# EAGLE design Adafruit eInk Feather Friend (EAGLE 9.5.0)
COMPANY: ADAFRUIT INDUSTRIES; DRAWN: K. TOWNSEND; REV: A
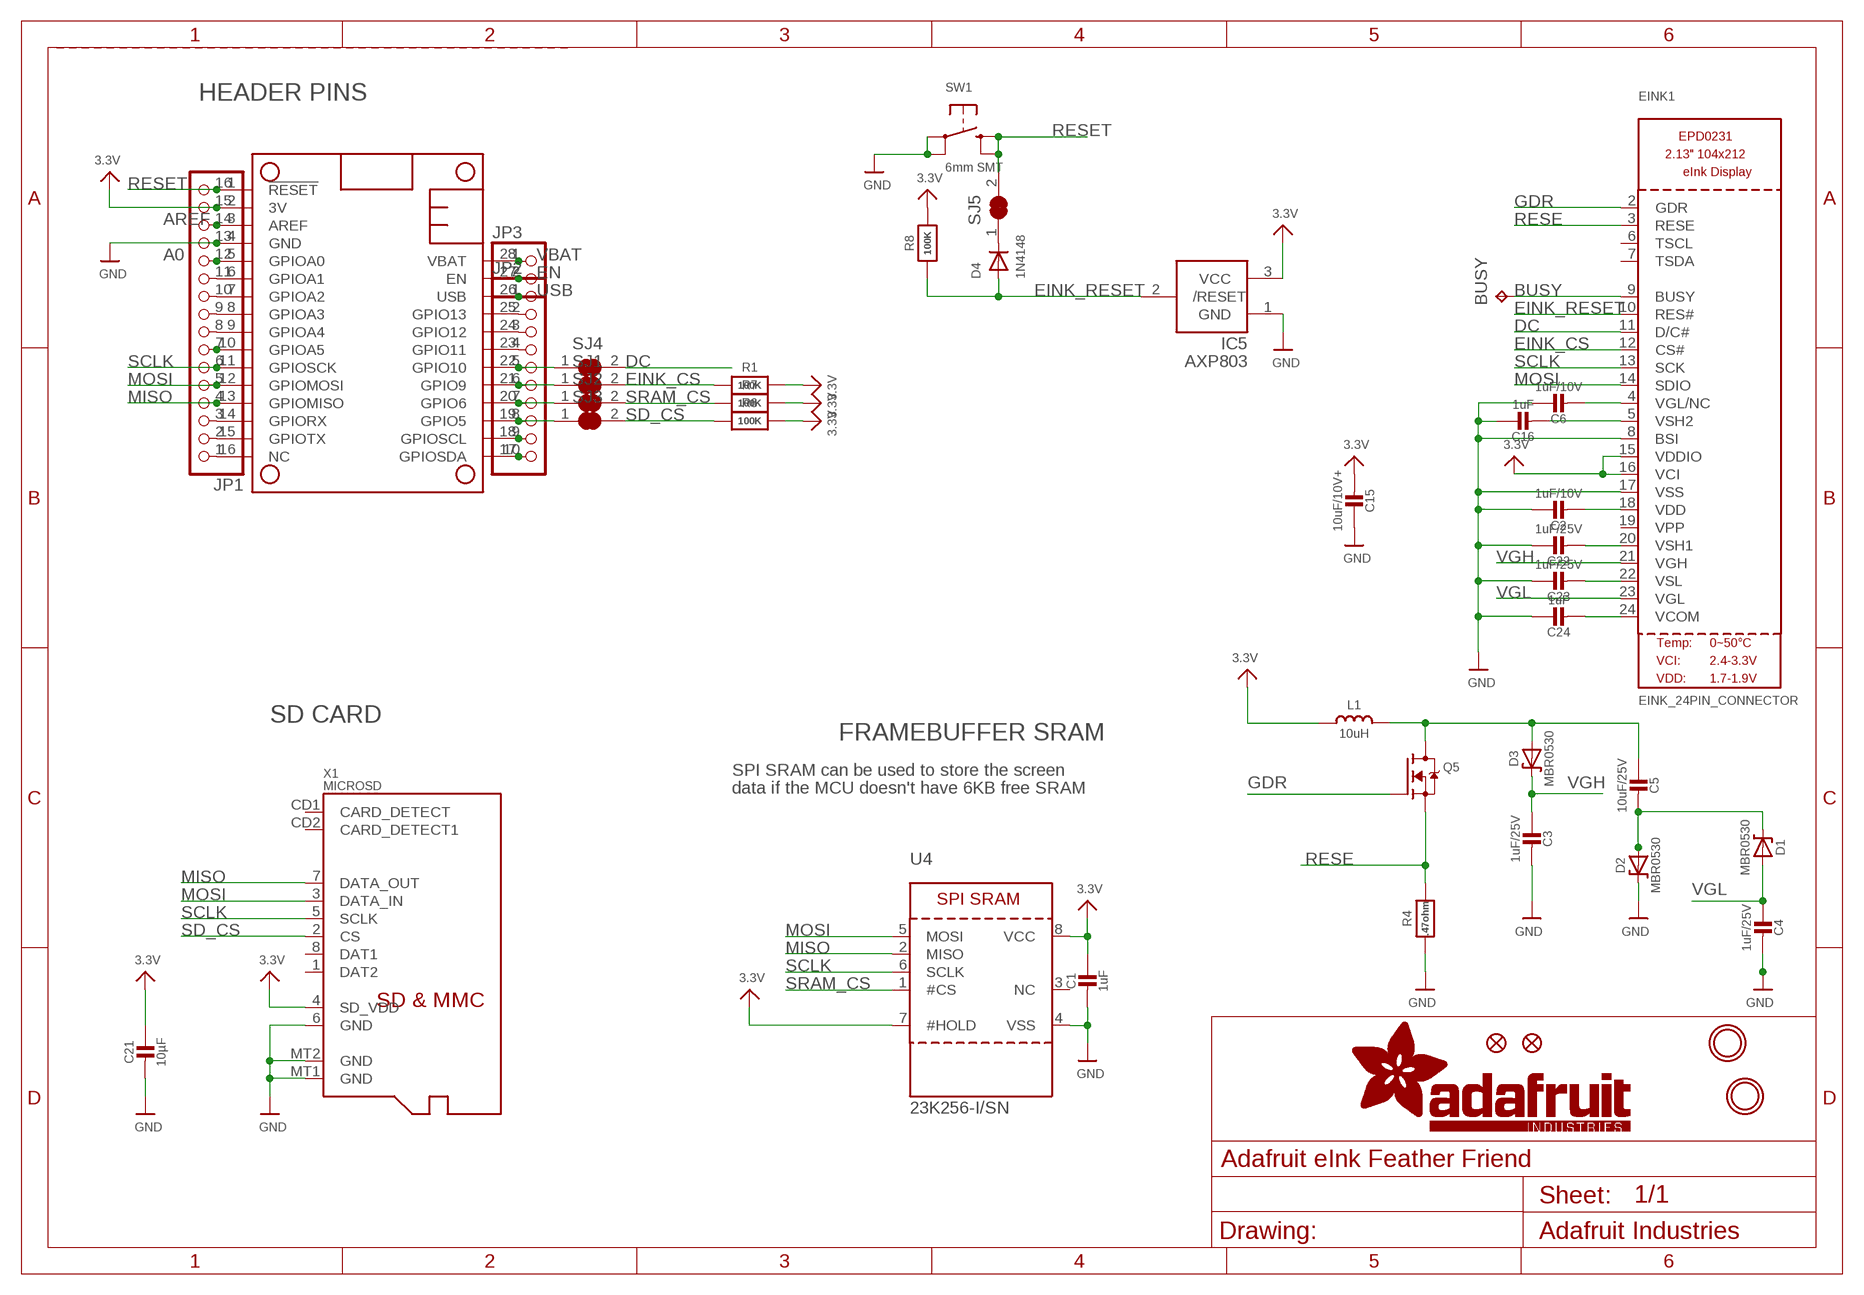
[diagram p0: schematic, sheet 1]

## Parts
BUSY  TPTP15SQ  [TP15SQ]
C1  1uF  CAP_CERAMIC0805_10MGAP  [0805_10MGAP]
C2  1uF/10V  CAP_CERAMIC0805-NOOUTLINE  [0805-NO]
C3  1uF/25V  CAP_CERAMIC0805-NOOUTLINE  [0805-NO]
C4  1uF/25V  CAP_CERAMIC0805-NOOUTLINE  [0805-NO]
C5  10uF/25V  CAP_CERAMIC0805-NOOUTLINE  [0805-NO]
C6  1uF/10V  CAP_CERAMIC0805-NOOUTLINE  [0805-NO]
C15  10uF/10V+  CAP_CERAMIC0805-NOOUTLINE  [0805-NO]
C16  1uF  CAP_CERAMIC0805-NOOUTLINE  [0805-NO]
C21  10µF  CAP_CERAMIC0805-NOOUTLINE  [0805-NO]
C22  1uF/25V  CAP_CERAMIC0805-NOOUTLINE  [0805-NO]
C23  1uF/25V  CAP_CERAMIC0805-NOOUTLINE  [0805-NO]
C24  1uF  CAP_CERAMIC0805-NOOUTLINE  [0805-NO]
D1  MBR0530  DIODE-SCHOTTKYSOD-123  [SOD-123]
D2  MBR0530  DIODE-SCHOTTKYSOD-123  [SOD-123]
D3  MBR0530  DIODE-SCHOTTKYSOD-123  [SOD-123]
D4  1N4148  DIODESOD-323F  [SOD-323F]
EINK1  EINK_24PIN_CONNECTOR  [EINK_24PIN]
FID1  FIDUCIAL_1MM  [FIDUCIAL_1MM]
FID3  FIDUCIAL_1MM  [FIDUCIAL_1MM]
IC5  AXP803  AXP083-SAG  [SOT23]
JP1  HEADER-1X16ROUND  [1X16_ROUND]
JP2  HEADER-1X10ROUND  [1X10_ROUND]
JP3  HEADER-1X2ROUND  [1X02_ROUND]
L1  10uH  INDUCTORNR401  [INDUCTOR_4X4MM_NR401]
MS1  FEATHERWING_NOHOLES  [FEATHERWING_NOHOLES]
Q5  IRLML0100  IRLML2060TRPBF  [SOT23-3]
R1  100K  RESISTOR_0603_NOOUT  [0603-NO]
R4  .47ohm  RESISTOR0805_10MGAP  [0805_10MGAP]
R6  100K  RESISTOR_0603_NOOUT  [0603-NO]
R7  100K  RESISTOR_0603_NOOUT  [0603-NO]
R8  100K  RESISTOR_0603_NOOUT  [0603-NO]
SJ1  SOLDERJUMPER_CLOSED  [SOLDERJUMPER_CLOSEDWIRE]
SJ2  SOLDERJUMPER_CLOSED  [SOLDERJUMPER_CLOSEDWIRE]
SJ3  SOLDERJUMPER_CLOSED  [SOLDERJUMPER_CLOSEDWIRE]
SJ4  SOLDERJUMPER_CLOSED  [SOLDERJUMPER_CLOSEDWIRE]
SJ5  SOLDERJUMPER_CLOSED  [SOLDERJUMPER_CLOSEDWIRE]
SW1  6mm SMT  SWITCH_TACT_SMT4.6X2.8  [BTN_KMR2_4.6X2.8]
U4  23K256-I/SN  SRAM_SPI_SOIC8  [SOIC8_150MIL]
U$3  MOUNTINGHOLE2.5  [MOUNTINGHOLE_2.5_PLATED]
U$4  MOUNTINGHOLE2.5  [MOUNTINGHOLE_2.5_PLATED]
X1  MICROSD  [MICROSD]

## Nets
3.3V: C1.1 C15.2 C21.1 EINK1.15(VDDIO) EINK1.16(VCI) IC5.3(VCC) JP1.15 L1.P$2 MS1.2(3V) R1.2 R6.2 R7.2 R8.2 U4.7(#HOLD) U4.8(VCC) X1.4(SD_VDD)
A0: JP1.12 MS1.5(GPIOA0)
AREF: JP1.14 MS1.3(AREF)
BUSY: BUSY.TP EINK1.9(BUSY)
DC: EINK1.11(D/C#) SJ4.2
EINK_CS: EINK1.12(CS#) R1.1 SJ1.2
EINK_RESET: D4.A EINK1.10(RES#) IC5.2(/RESET) R8.1
EN: JP3.2 MS1.27(EN)
GDR: EINK1.2(GDR) Q5.1(G)
GND: C1.2 C2.1 C3.2 C4.2 C6.1 C15.1 C16.1 C21.2 C22.1 C23.1 C24.1 D2.C EINK1.8(BSI) EINK1.17(VSS) IC5.1(GND) JP1.13 MS1.4(GND) R4.2 SW1.A'(P1) SW1.A(P) U4.4(VSS) X1.6(GND) X1.MT1(GND) X1.MT2(GND)
H: JP2.8 MS1.19(GPIO5) SJ3.1
I: JP2.7 MS1.20(GPIO6) SJ2.1
J: JP2.6 MS1.21(GPIO9) SJ1.1
K: JP2.5 MS1.22(GPIO10) SJ4.1
MISO: JP1.4 MS1.13(GPIOMISO) U4.2(MISO) X1.7(DATA_OUT)
MOSI: EINK1.14(SDIO) JP1.5 MS1.12(GPIOMOSI) U4.5(MOSI) X1.3(DATA_IN)
N$1: JP1.7 MS1.10(GPIOA5)
N$2: C5.2 D1.C D2.A
N$3: C5.1 D3.A L1.P$1 Q5.3(D)
N$4: C16.2 EINK1.5(VSH2)
N$5: C2.2 EINK1.18(VDD)
N$6: C22.2 EINK1.20(VSH1)
N$7: D4.C SJ5.1
N$8: JP1.11 MS1.6(GPIOA1)
N$9: C6.2 EINK1.4(VGL/NC)
N$10: JP1.10 MS1.7(GPIOA2)
N$11: JP1.9 MS1.8(GPIOA3)
N$12: JP1.8 MS1.9(GPIOA4)
N$14: JP1.3 MS1.14(GPIORX)
N$15: JP1.2 MS1.15(GPIOTX)
N$16: JP1.1 MS1.16(NC)
N$17: JP2.10 MS1.17(GPIOSDA)
N$18: JP2.9 MS1.18(GPIOSCL)
N$19: JP2.4 MS1.23(GPIO11)
N$20: JP2.3 MS1.24(GPIO12)
N$21: JP2.2 MS1.25(GPIO13)
N$27: C23.2 EINK1.22(VSL)
N$33: C24.2 EINK1.24(VCOM)
RESE: EINK1.3(RESE) Q5.2(S) R4.1
RESET: JP1.16 MS1.1(!RESET) SJ5.2 SW1.B'(S1) SW1.B(S)
SCLK: EINK1.13(SCK) JP1.6 MS1.11(GPIOSCK) U4.6(SCLK) X1.5(SCLK)
SD_CS: R6.1 SJ3.2 X1.2(CS)
SRAM_CS: R7.1 SJ2.2 U4.1(#CS)
USB: JP2.1 MS1.26(USB)
VBAT: JP3.1 MS1.28(VBAT)
VGH: C3.1 D3.C EINK1.21(VGH)
VGL: C4.1 D1.A EINK1.23(VGL)
Unconnected: EINK1.6(TSCL) EINK1.7(TSDA) EINK1.19(VPP) U4.3(NC) X1.1(DAT2) X1.8(DAT1) X1.CD1(CARD_DETECT) X1.CD2(CARD_DETECT1)

## Notes on the sheet
- HEADER PINS
- SD CARD
- FRAMEBUFFER SRAM
- SPI SRAM can be used to store the screen
- data if the MCU doesn't have 6KB free SRAM

## Library data of the parts
BUSY = testpad:TP: Test pad
C1 = microbuilder:CAP_CERAMIC: Ceramic Capacitors For new designs, use the packages preceded by an '_' character since they are more reliable: The following footprints should be used on most boards: _0402 - Standard footprint for regular board layouts _0603 - Standard footprint for regular board layouts _0805 - Standard footprint for regular board layouts _1206 - Standard footprint for regular board layouts For extremely tight-pitch boards where space is at a premium, the following 'micro-pitch' footprints can be used (smaller pads, no silkscreen outline, etc.): _0402MP - Micro-pitch footprint for very dense/compact boards _0603MP - Micro-pitch footprint for very dense/compact boards _0805MP - Micro-pitch footprint for very dense/compact boards _1206MP - Micro-pitch footprint for very dense/compact boards; REV: A
C2-C6 C15 C16 C21-C24 = microbuilder:CAP_CERAMIC: Ceramic Capacitors For new designs, use the packages preceded by an '_' character since they are more reliable: The following footprints should be used on most boards: _0402 - Standard footprint for regular board layouts _0603 - Standard footprint for regular board layouts _0805 - Standard footprint for regular board layouts _1206 - Standard footprint for regular board layouts For extremely tight-pitch boards where space is at a premium, the following 'micro-pitch' footprints can be used (smaller pads, no silkscreen outline, etc.): _0402MP - Micro-pitch footprint for very dense/compact boards _0603MP - Micro-pitch footprint for very dense/compact boards _0805MP - Micro-pitch footprint for very dense/compact boards _1206MP - Micro-pitch footprint for very dense/compact boards
D1-D3 = microbuilder:DIODE-SCHOTTKY
D4 = adafruit:DIODE: Diode SMADIODE - SMA Surface Mount Package 20V 1A Schottky Diode Digikey: 641-1014-6-ND DO-1N4148 - Through Hole Small Current Diode SOD-123 20V 1 A (.5mV Vf) Schottky Diode - Digikey: MBRX120TPMSCT-ND SOD-323 10V 570mA (.38mV Vf, 3ns) Schottky Diode - Digikey: ZLLS410CT-ND SOD-523 30V 30mA Schottky Diode (RB751S-40TE61) - Digikey: RB751S-40TE61CT-ND SOT23-R/W - SOT23 Package (R = Solder Paste/Reflow Ovens, W = Hand-Soldering) BAT54Film 40V 300mA - Digikey: 497-7162-1-ND
EINK1 = adafruit_display:EINK_24PIN
FID1 FID3 = microbuilder:FIDUCIAL: Fiducial Alignment Points Various fiducial points for machine vision alignment.; BOM: EXCLUDE
IC5 = adafruit:AXP083
JP1 = microbuilder:HEADER-1X16: PIN HEADER
JP2 = microbuilder:HEADER-1X10: PIN HEADER
JP3 = microbuilder:HEADER-1X2: PIN HEADER
L1 = microbuilder:INDUCTOR: Inductors 0603: 10nH Ceramic Inductor - microwire antenna/RF (Digikey: 712-1434-2-ND) 0805: 560nH Ceramic Inductor - RF (Digikey: 553-1047-1-ND) 270nH Ceramic Inductor - Q = 40@250MHz, +-5%, 1 Ohm DC Resistance (Digikey: 535-10506-2-ND) 1007 (2518 Metric) SMT: 10µH 10% 250mOhm 820mA 1007 Inductor (Digikey: 587-2189-1-ND) 22µH 10% 500mOhm 580mA 1007 Inductor (Digikey: 587-2190-1-ND) 47µH 10% 950mOhm 420mA 1007 Inductor (Digikey: 587-2191-1-ND) 47µH 5% 100mOhm 1A 1008 Inductor (Digikey: 732-1816-1-ND) 5.0x5.0mm (Taiyo Yuden NR5040 Series) 6.8µH 20% 2.3A 64mOhm Inductor (Digikey: 587-2374-2-ND) 5.0x5.0mm (TDK VLC5045 Series) 4.7µH 20% 3.3A 34mOhm Inductor (Digikey: 445-6526-1-ND) 6.8µH 20% 2.7A 46mOhm Inductor (Digikey: 445-6527-1-ND) 6.0x6.0mm (TDK VLC6045 Series) 4.7µH 20% 3.8A 27mOhm Inductor (Digikey: 445-6538-2-ND) 6.8µH 20% 3A 41mOhm Inductor (Digikey: 445-6540-1-ND) 6.2µH 30% 2.2A 45mOhm Inductor (Digikey: SRR5028-6R2YCT-ND) - Not TDK VLC6045 but footprint should match 6.0x6.0mm (TDK SLF6045 Series) 6.8uH 30% 2A 33mOhm Inductor (Digikey: 445-4572-1-ND, Mouser: 810-SLF645T6R8N2R0PF) 6.0x6.0mm (Sumida CDRH5D28 Series) 6.2uH 30% 1.8A 45mOhm Inductor (Digikey: 308-1542-1-ND) Taiyo Yuden NR3015T2R2M - 2.2uH 20% 1.5A (Digikey: 587-1648-2-ND, Mouser: 963-NR3015T2R2M) - Used with TI TPS62172 CoilCraft RFID Transponder Coil - MA5532-AE (For use with AS3935 Lightning Sensor) Taiyo Yuden NRH2412T2R2MNGH - 2.2uH 20% 1AA (Digikey: 587-3443-1-ND) - Used with TI LM3671 Vishay IHLP 1.0uH Molded Inductor - 24mOhm DCR, 5A, +/-20%, -55°C-125°C (Digikey: 541-1319-1-ND)
MS1 = microbuilder:FEATHERWING
Q5 = Parts:IRLML2060TRPBF
R1 R4 R6-R8 = microbuilder:RESISTOR: Resistors For new designs, use the packages preceded by an '_' character since they are more reliable: The following footprints should be used on most boards: _0402 - Standard footprint for regular board layouts _0603 - Standard footprint for regular board layouts _0805 - Standard footprint for regular board layouts _1206 - Standard footprint for regular board layouts For extremely tight-pitch boards where space is at a premium, the following 'micro-pitch' footprints can be used (smaller pads, no silkscreen outline, etc.): _0402MP - Micro-pitch footprint for very dense/compact boards _0603MP - Micro-pitch footprint for very dense/compact boards _0805MP - Micro-pitch footprint for very dense/compact boards _1206MP - Micro-pitch footprint for very dense/compact boards
SJ1-SJ5 = microbuilder:SOLDERJUMPER_CLOSED: Solder Jumper - Closed These solder jumpers are closed by default CLOSEDWIRE - 10 mil trace between pads that can be cut and resoldered later CLOSEDPERM - 63 mil trace between pads for a permanent connection (used to 'bridge' two signals, a shameless hack for Eagle). Can double as a test point as well (no cream layer)
SW1 = microbuilder:SWITCH_TACT_SMT: SMT Tact Switches 6x6mm - Digikey: P12940SCT-ND KMR2 (4.6x2.8mm) - Digikey: 401-1426-1-ND EVQ-PQHB55 - Light Touch, 160GF (4.5x4.5mm) - Digikey: P8090SCT-ND KMT0 - KMT021 NGJ LHS (etc.) IP68/Waterproof - Digikey: CKN10289CT-ND
U4 = microbuilder:SRAM_SPI_SOIC8: SRAM - 8-Pin SPI Interface 23K640-I/SN - 8KB (64Kb), 20MHz, 2.7-3.6V 23K256-I/SN - 32KB (256Kb), 20MHz, 2.7-3.6V 23LC512-I/SN - 64KB (512Kb), 20MHz, 2.7-3.6V
U$3 U$4 = microbuilder:MOUNTINGHOLE: Mounting Hole For #2 screws (0.086"/2.18mm width, 0.094"/2.4mm hole) use 2.5mm; BOM: EXCLUDE
X1 = microbuilder:MICROSD: MicroSD/Transflash Card Holder with SPI pinout 3M: 2908-05WB-MG 4UConnector: 19656 Footprint courtesy: Adafruit Industries

## Board
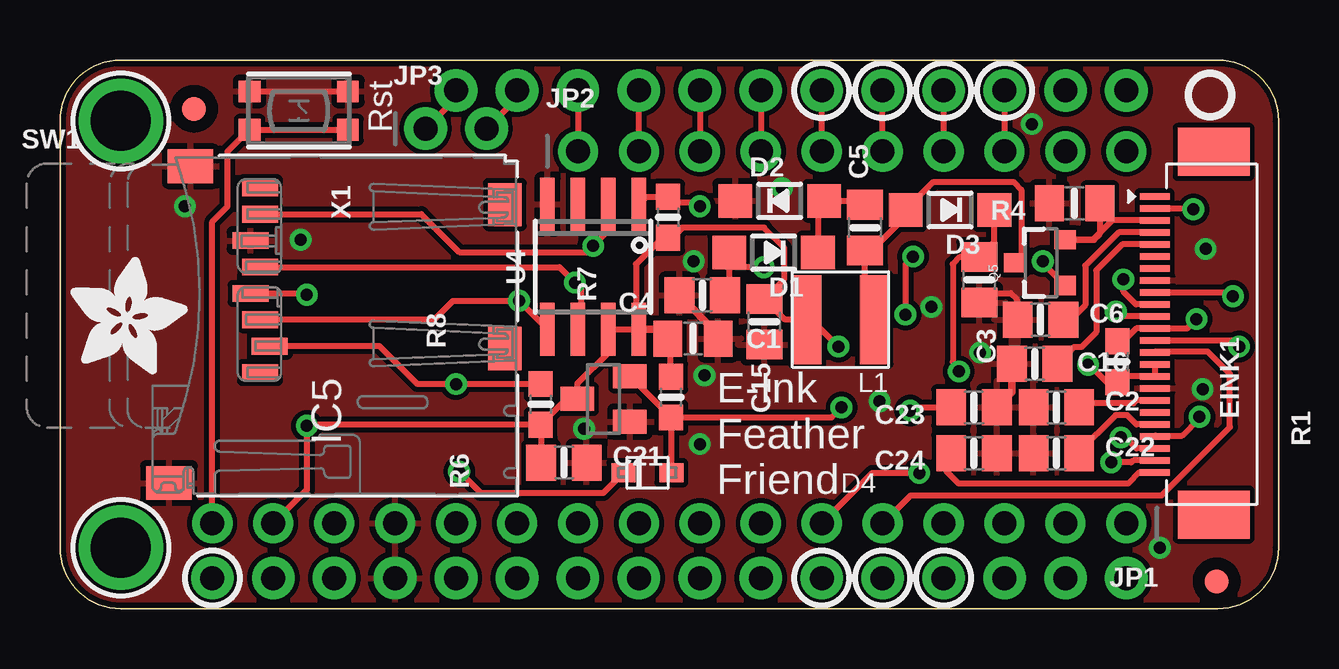
[diagram p1: board, top side]
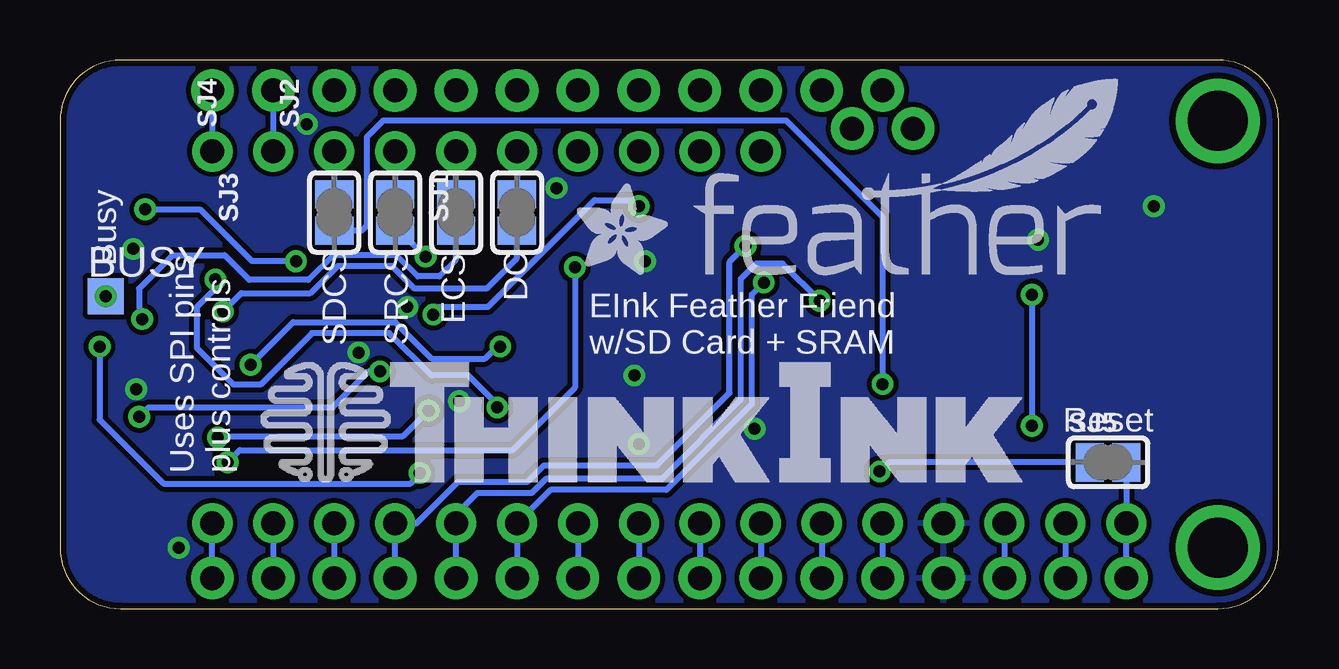
[diagram p2: board, bottom side, seen from below]

Size 50.8 x 22.86 mm. Coordinates in mm from the lower left corner, seen from the top.
Outline: 50.8,20.32 50.8,2.54 arc-90 48.26,0 2.54,0 arc-90 0,2.54 0,20.32 arc-90 2.54,22.86 48.26,22.86 arc-90 50.8,20.32
Copper layers (1*16): Top 0.035mm / dielectric 1.5mm / Bottom 0.035mm
Design rules "adafruit *": minimum track width 8mil, minimum drill 15.5mil, track to track 8mil, track to pad 8mil, pad to pad 8mil, via to via 8mil, smd to smd 8mil, copper to edge 10mil, drill to drill 8mil, minimum pad ring 10mil, minimum via ring 8mil, stop-mask expansion 2mil, vias tented up to drill 20mil, thermal gap 10mil

### Footprints (pad centres in the part's own frame; a part is rotated, then mirrored left to right if it is on the bottom)
TP15SQ = smd 1.5 x 1.5: TP 0,0
0805_10MGAP = smd 1.2 x 1.5: 1 -1.05,0; 2 1.05,0
0805-NO = smd 1.24 x 1.5: 1 -0.95,0; 2 0.95,0
SOD-123 = smd 1.4 x 1.4: A 1.85,0; C -1.85,0
SOD-323F = smd 1 x 0.8: A -1,0; C 1,0
EINK_24PIN = smd 0.275 x 1.25: 1 -5.75,-2.25; 2 -5.25,-2.25; 3 -4.75,-2.25; 4 -4.25,-2.25; 5 -3.75,-2.25; 6 -3.25,-2.25; 7 -2.75,-2.25; 8 -2.25,-2.25; 9 -1.75,-2.25; 10 -1.25,-2.25; 11 -0.75,-2.25; 12 -0.25,-2.25; 13 0.25,-2.25; 14 0.75,-2.25; 15 1.25,-2.25; 16 1.75,-2.25; 17 2.25,-2.25; 18 2.75,-2.25; 19 3.25,-2.25; 20 3.75,-2.25; 21 4.25,-2.25; 22 4.75,-2.25; 23 5.25,-2.25; 24 5.75,-2.25 | smd 2 x 3: SPRT1 -7.6,0.21; SPRT2 7.51,0.21
FIDUCIAL_1MM = smd 1 x 1: 1 0,0
SOT23 = smd 1 x 1.4: 1 -0.95,-1.1; 2 0.95,-1.1; 3 0,1.1
1X16_ROUND = drill 1 pad 1.676: 1 -19.05,0; 2 -16.51,0; 3 -13.97,0; 4 -11.43,0; 5 -8.89,0; 6 -6.35,0; 7 -3.81,0; 8 -1.27,0; 9 1.27,0; 10 3.81,0; 11 6.35,0; 12 8.89,0; 13 11.43,0; 14 13.97,0; 15 16.51,0; 16 19.05,0
1X10_ROUND = drill 1 pad 1.676: 1 -11.43,0; 2 -8.89,0; 3 -6.35,0; 4 -3.81,0; 5 -1.27,0; 6 1.27,0; 7 3.81,0; 8 6.35,0; 9 8.89,0; 10 11.43,0
1X02_ROUND = drill 1 pad 1.778: 1 -1.27,0; 2 1.27,0
INDUCTOR_4X4MM_NR401 = smd 1.2 x 3.7: P$1 -1.4,0; P$2 1.4,0
FEATHERWING_NOHOLES = drill 1 pad 1.778: 1 6.35,1.27; 2 8.89,1.27; 3 11.43,1.27; 4 13.97,1.27; 5 16.51,1.27; 6 19.05,1.27; 7 21.59,1.27; 8 24.13,1.27; 9 26.67,1.27; 10 29.21,1.27; 11 31.75,1.27; 12 34.29,1.27; 13 36.83,1.27; 14 39.37,1.27; 15 41.91,1.27; 16 44.45,1.27; 17 44.45,21.59; 18 41.91,21.59; 19 39.37,21.59; 20 36.83,21.59; 21 34.29,21.59; 22 31.75,21.59; 23 29.21,21.59; 24 26.67,21.59; 25 24.13,21.59; 26 21.59,21.59; 27 19.05,21.59; 28 16.51,21.59
SOT23-3 = smd 0.8 x 0.9: 1 -0.95,-1; 2 0.95,-1; 3 0,1.1
0603-NO = smd 1.075 x 1: 1 -0.85,0; 2 0.85,0
SOLDERJUMPER_CLOSEDWIRE = smd 1.168 x 1.6: 1 -0.762,0; 2 0.762,0 | smd 0.635 x 0.203: WIRE 0,0
BTN_KMR2_4.6X2.8 = smd 0.9 x 0.9: A 2.05,0.8; A' -2.05,0.8; B 2.05,-0.8; B' -2.05,-0.8
SOIC8_150MIL = smd 0.6 x 2.2: 1 -1.905,-2.6; 2 -0.635,-2.6; 3 0.635,-2.6; 4 1.905,-2.6; 5 1.905,2.6; 6 0.635,2.6; 7 -0.635,2.6; 8 -1.905,2.6
MOUNTINGHOLE_2.5_PLATED = drill 2.5 pad 3.2: P$1 0,0
MICROSD = smd 0.7 x 1.5: 1 9,-10.64; 2 7.9,-10.24; 3 6.8,-10.64; 4 5.7,-11.04; 5 4.6,-10.64; 6 3.5,-11.04; 7 2.4,-10.64; 8 1.3,-10.64 | smd 1.8 x 1.4: CD1 2,-0.44; CD2 8,-0.44 | smd 1.4 x 1.9: MT1 0.4,-13.54; MT2 13.6,-14.44

### Placement (x,y rotation side)
BUSY  48.9,13.02 0 bottom
C1  26.39,11.25 0 top
C2  41.53,8.38 0 top
C3  38.32,13.7 270 top
C4  26.77,13.06 180 top
C5  33.55,15.88 90 top
C6  40.87,12.04 0 top
C15  29.36,11.95 90 top
C16  40.63,10.2 0 top
C21  21.01,6.09 0 top
C22  41.53,6.48 0 top
C23  38.1,8.38 180 top
C24  38.1,6.48 180 top
D1  29.74,14.83 180 top
D2  30,16.99 0 top
D3  37.1,16.61 180 top
D4  24.49,5.66 180 top
EINK1  47.88,11.43 270 top
FID1  48.21,1.14 0 top
FID3  5.59,20.83 0 top
IC5  22.66,8.74 90 top
JP1  25.4,3.56 180 top
JP2  33.02,19.05 0 top
JP3  16.51,20 0 top
L1  32.54,12.04 180 top
MS1  0,0 0 top
Q5  40.89,14.41 90 top
R1  44.07,10.29 270 top
R4  42.29,16.89 180 top
R6  20.04,8.51 270 top
R7  25.35,16.31 270 top
R8  25.48,8.81 90 top
SJ1  34.29,16.51 270 bottom
SJ2  36.83,16.51 270 bottom
SJ3  39.37,16.51 270 bottom
SJ4  31.75,16.51 270 bottom
SJ5  7.11,6.1 0 bottom
SW1  9.96,20.75 0 top
U4  22.22,14.24 180 top
U$3  2.54,20.32 0 top
U$4  2.54,2.54 0 top
U$5  [THINKINK_1.25IN]  42.42,5.27 0 bottom
U$6  [FEATHERLOGO_MED]  24.51,13.84 0 bottom
U$8  [ADAFRUIT_5MM]  0.44,9.78 0 top
U$9  [PCBFEAT-REV-040]  47.94,21.4 0 top
U$17  [ADAFRUIT_3.5MM]  29.27,13.91 0 bottom
X1  18.98,18.84 270 top

### Tracks (layer width: path | path; a pad name or v marks a point on that pad's centre or on a via)
3.3V  (via drill 0.5)
  Top 0.254: 24,11.64 U4.7 22.86,10.67 21.56,9.37 IC5.3 21.12,8.74 R6.2 | 24,11.64 U4.8 | C1.1 25.43,11.16 25.43,10.1 25.48,10.04 R8.2 | R7.2 25.53,15.46 | 24,11.64 24,14.35 24.98,15.33 25.4,15.33 25.53,15.46 | X1.4 10.23,13.13 v10.29,13.08 | R6.2 10.33,7.66 v10.29,7.62 10.29,4.95 JP1.15 | EINK1.15 EINK1.16 44.31,9.68 R1.2 43.64,9.44 42.92,10.16 v42.85,10.16 | v32.45,10.92 31.33,12.04 L1.P$2 30.22,12.04 C15.2 30.19,13.74 30.19,15.04 29.35,15.88 25.95,15.88 25.53,15.46 | R6.2 20.06,7.64 C21.1
  Top 0.305: U4.8 24.94,11.64 25.43,11.16
  Bottom 0.254: JP1.15 MS1.2 | v10.29,13.08 v10.29,7.62 | v42.85,10.16 41.08,11.94 36.83,11.94 35.31,10.41 33.08,10.41 32.58,10.92 v32.45,10.92
A0
  Bottom 0.254: JP1.12 MS1.5
AREF
  Bottom 0.254: JP1.14 MS1.3
BUSY  (via drill 0.5)
  Top 0.254: EINK1.9 48.73,13.18 BUSY.TP
  other vias: 48.9,13.02
DC  (via drill 0.5)
  Top 0.254: EINK1.11 44.21,12.18 v44.01,12.38
  Bottom 0.254: SJ4.2 31.75,14.61 33.02,13.34 36.02,13.34 36.96,14.28 39.22,14.28 40.35,13.14 43.24,13.14 v44.01,12.38
EINK_CS  (via drill 0.5)
  Top 0.254: v47.37,12.06 46.99,11.68 EINK1.12 44.87,11.68 44.32,11.14 R1.1
  Bottom 0.254: v47.37,12.06 47.5,12.19 47.5,13.34 46.1,14.73 43.94,14.73 42.91,13.7 40.45,13.7 39.41,14.73 36.77,14.73 35.88,13.84 34.99,13.84 34.29,14.54 SJ1.2
EINK_RESET  (via drill 0.5)
  Top 0.254: EINK1.10 44.85,12.68 44.32,13.21 v44.32,13.72 | v32.58,8.38 32.16,7.96 R8.1 | IC5.2 R8.1 | R8.1 25.48,5.67 D4.A
  Bottom 0.254: v44.32,13.72 44.32,13.34 45.09,12.57 45.09,10.86 43.56,9.34 42.44,9.34 40.3,11.48 37.07,11.48 35.31,9.72 33.78,9.72 32.58,8.51 v32.58,8.38
EN
  Top 0.254: MS1.27 19.05,21.27 JP3.2
GDR  (via drill 0.5)
  Top 0.254: Q5.1 40.92,14.44 v40.96,14.48 | EINK1.2 47.2,16.68 v47.24,16.64
  Bottom 0.254: v47.24,16.64 44.96,16.64 42.8,14.48 v40.96,14.48
GND  (via drill 0.5)
  Top 0.254: SW1.A' SW1.A | C3.2 38.71,13.14 39.62,13.14 39.88,12.89 39.88,12.08 C6.1
  Top 0.305: C4.2 27.43,11.44 C1.2 | C16.1 39.68,9.01 C23.1
  other vias: 10.03,15.37 5.21,16.76 26.42,14.48 30.1,17.53 26.86,9.72 34.16,8.64 47.75,14.99 47.62,9.14 21.84,7.49 38.35,10.67 45.85,2.54 26.67,6.86 40.51,20.19 36.32,12.57
  pour Top: 0,22.86 0,0 50.8,0 50.8,22.86
  pour Bottom: 0,22.86 0,0 50.8,0 50.8,22.86
H
  Top 0.254: MS1.19 JP2.8
  Bottom 0.254: JP2.8 SJ3.1
I
  Top 0.254: MS1.20 JP2.7
  Bottom 0.254: JP2.7 SJ2.1
J
  Top 0.254: JP2.6 MS1.21
  Bottom 0.254: SJ1.1 JP2.6
K
  Top 0.254: JP2.5 MS1.22
  Bottom 0.254: JP2.5 SJ4.1
MISO  (via drill 0.5)
  Top 0.254: X1.7 15.06,16.43 16.64,14.86 21.97,14.86 v22.23,15.11 22.86,15.74 U4.2
  Bottom 0.254: MS1.13 JP1.4 35.94,3.56 34.22,5.28 31.32,5.28 30.63,5.97 25.91,5.97 22.89,8.99 22.89,14.45 v22.23,15.11
MOSI  (via drill 0.5)
  Top 0.254: U4.5 v19.13,12.83 16.38,12.83 15.59,12.04 X1.3 | JP1.5 35.46,4.72 45.93,4.72 48.77,7.57 48.77,9.78 47.84,10.71 45.66,10.71 EINK1.14
  Bottom 0.254: MS1.12 JP1.5 34.29,3.94 33.4,4.83 31.13,4.83 30.54,5.41 25.72,5.41 22.43,8.7 22.43,13.73 21.79,14.37 20.68,14.37 v19.13,12.83
N$1
  Bottom 0.254: JP1.7 MS1.10
N$2
  Top 0.254: D1.C 31.59,16.74 D2.A 33.39,16.99 C5.2
N$3
  Top 0.254: Q5.3 40.07,14.69 40.07,17.46 39.75,17.78 36.41,17.78 D3.A 35.25,16.32 33.85,14.93 C5.1 33.55,12.42 L1.P$1
N$4
  Top 0.254: EINK1.5 44.27,15.18 43.19,14.1 43.19,11.51 42.58,10.9 42.27,10.9 C16.2
N$5
  Top 0.254: EINK1.18 44.87,8.68 44.74,8.55 42.65,8.55 C2.2
N$6
  Top 0.254: EINK1.20 44.87,7.68 44.49,8.06 44,8.06 42.48,6.54 C22.2
N$7  (via drill 0.5)
  Top 0.254: v16.64,5.71 17.53,4.83 22.65,4.83 D4.C
  Bottom 0.254: SJ5.1 16.26,6.1 v16.64,5.71
N$8
  Bottom 0.254: JP1.11 MS1.6
N$9
  Top 0.254: EINK1.4 44.13,15.68 42.74,14.29 42.74,12.64 42.14,12.04 C6.2
N$10
  Bottom 0.254: JP1.10 MS1.7
N$11
  Bottom 0.254: JP1.9 MS1.8
N$12
  Bottom 0.254: JP1.8 MS1.9
N$14
  Bottom 0.254: JP1.3 MS1.14
N$15
  Bottom 0.254: JP1.2 MS1.15
N$16
  Bottom 0.254: MS1.16 JP1.1
N$17
  Bottom 0.254: MS1.17 JP2.10
N$18
  Bottom 0.254: MS1.18 JP2.9
N$19
  Top 0.254: MS1.23 JP2.4
N$20
  Top 0.254: MS1.24 JP2.3
N$21
  Top 0.254: JP2.2 MS1.25
N$27  (via drill 0.5)
  Top 0.254: EINK1.22 44.87,6.68 44.41,7.13 v44.22,7.13 | v35.43,8.26 35.56,8.38 C23.2
  Bottom 0.254: v44.22,7.13 44.16,7.19 36.5,7.19 v35.43,8.26
N$33
  Top 0.254: EINK1.24 44.99,5.68 44.52,5.21 37.47,5.21 36.96,5.71 36.96,6.28 C24.2
RESE
  Top 0.254: EINK1.3 43.87,16.18 43.05,15.36 Q5.2 43.1,15.36 43.34,15.61 R4.1
RESET
  Top 0.254: SW1.B SW1.B' 7.89,19.95 6.99,19.05 6.99,16.76 6.35,16.13 JP1.16
  Bottom 0.254: MS1.1 JP1.16 6.35,3.62 6.35,4.25 SJ5.2
SCLK  (via drill 0.5)
  Top 0.254: X1.5 20.82,14.23 v21.46,13.59 21.72,13.34 21.72,11.78 U4.6 | EINK1.13 48.89,11.18 v49.15,10.92 | v35.81,5.65 33.85,5.65 JP1.6
  Bottom 0.254: MS1.11 31.72,1.3 31.75,1.33 JP1.6 30.35,4.95 25.53,4.95 21.97,8.51 21.97,13.08 v21.46,13.59 | v49.15,10.92 49.15,7.87 46.48,5.21 36.2,5.21 35.81,5.59 v35.81,5.65
SD_CS  (via drill 0.5)
  Top 0.254: R6.1 v16.51,9.36 14.9,9.36 13.32,10.94 X1.2
  Bottom 0.254: v16.51,9.36 16.51,16.32 20.54,20.34 37.31,20.34 38,19.66 38,15.98 38.23,15.75 SJ3.2
SRAM_CS  (via drill 0.5)
  Top 0.254: U4.1 24.44,17.16 R7.1 25.6,16.9 26.53,16.9 v26.67,16.76 | v35.56,14.67 35.24,14.35 v35.24,12.26
  Bottom 0.254: v26.67,16.76 26.92,17.02 28.51,17.02 32.97,12.56 35.24,12.56 v35.24,12.26 | SJ2.2 36.64,15.75 v35.56,14.67
USB
  Top 0.254: MS1.26 JP2.1
VBAT
  Top 0.254: MS1.28 16.51,21.27 JP3.1
VGH  (via drill 0.5)
  Top 0.254: EINK1.21 45.66,7.21 46.77,7.21 47.5,7.94 v47.5,7.99 | v37.47,9.88 37.47,10.03 37.21,10.29 37.21,14.35 37.51,14.65 C3.1 38.95,15.28 D3.C
  Bottom 0.254: v47.5,7.99 47.11,8.38 39.43,8.38 37.93,9.88 v37.47,9.88
VGL  (via drill 0.5)
  Top 0.254: EINK1.23 44.74,6.18 44.66,6.1 v43.81,6.1 | v29.34,14.22 27.84,14.22 27.84,14.78 D1.A 27.89,13.23 C4.1
  Bottom 0.254: v43.81,6.1 43.31,6.6 31.94,6.6 29.34,9.21 v29.34,14.22

### Text on the board
tPlace: Rst | E-Ink / Feather / Friend
bPlace: Busy | DC | ECS | SRCS | SDCS | EInk Feather Friend / w/SD Card + SRAM | Reset | Uses SPI pins / plus controls